# EAGLE design SlaveInput (EAGLE 9.3.2)
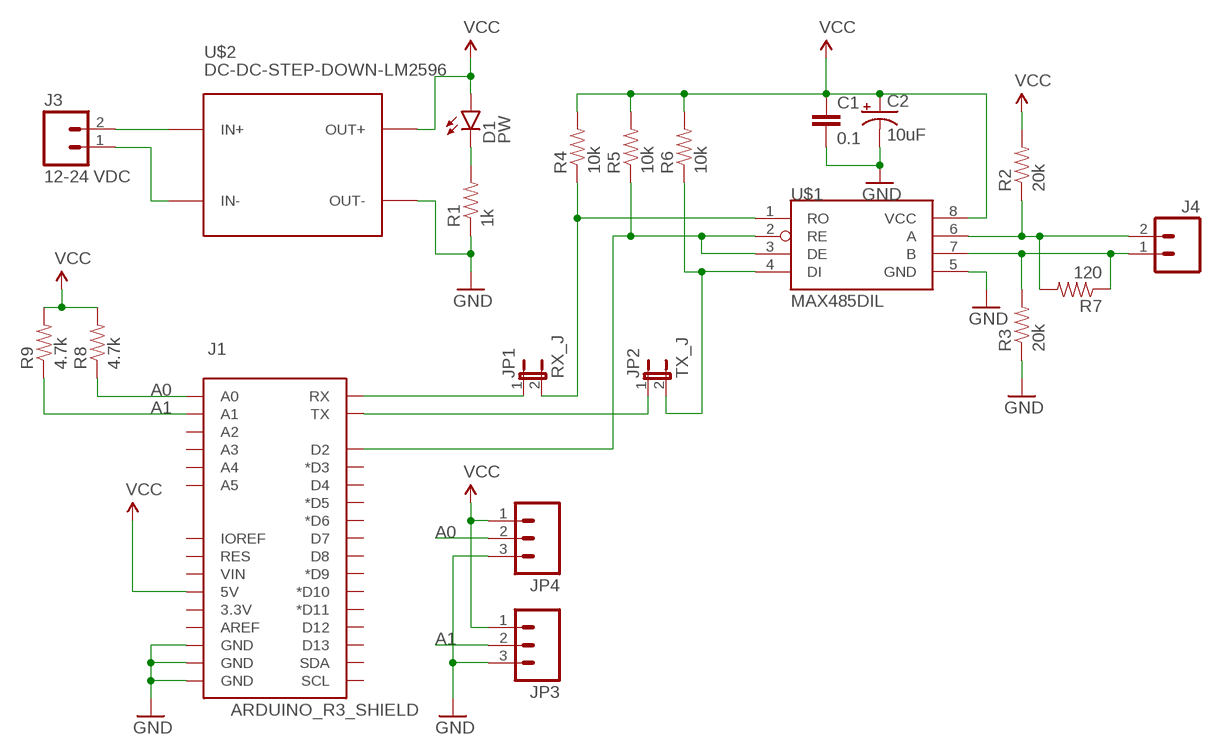
[diagram p0: schematic, sheet 1]

## Parts
C1  0.1  CAPPTH1  [CAP-PTH-5MM]
C2  10uF  CAP_POLPTH2  [CPOL-RADIAL-10UF-25V]
D1  PW  LED3MM  [LED3MM]
J1  ARDUINO_R3_SHIELD  [UNO_R3_SHIELD]
J3  12-24 VDC  M025MM  [SCREWTERMINAL-5MM-2]
J4  M025MM  [SCREWTERMINAL-5MM-2]
JP1  RX_J  JUMPER-2PTH  [1X02]
JP2  TX_J  JUMPER-2PTH  [1X02]
JP3  M03-SCREW-5MM  [SCREWTERMINAL-5MM-3]
JP4  M03-SCREW-5MM  [SCREWTERMINAL-5MM-3]
R1  1k  RESISTORAXIAL-0.3  [AXIAL-0.3]
R2  20k  RESISTORAXIAL-0.3  [AXIAL-0.3]
R3  20k  RESISTORAXIAL-0.3  [AXIAL-0.3]
R4  10k  RESISTORAXIAL-0.3  [AXIAL-0.3]
R5  10k  RESISTORAXIAL-0.3  [AXIAL-0.3]
R6  10k  RESISTORAXIAL-0.3  [AXIAL-0.3]
R7  120  RESISTORAXIAL-0.3  [AXIAL-0.3]
R8  4.7k  RESISTORAXIAL-0.3  [AXIAL-0.3]
R9  4.7k  RESISTORAXIAL-0.3  [AXIAL-0.3]
U$1  MAX485DIL  [DIL08]
U$2  DC-DC-STEP-DOWN-LM2596  [DC-DC-STEP-DOWN-LM2596]

## Nets
A0: J1.A0 JP4.2 R8.P$1
A1: J1.A1 JP3.2 R9.P$1
GND: C1.2 C2.2(-) J1.GND@0(GND) J1.GND@1(GND) J1.GND@2(GND) JP3.3 JP4.3 R1.P$1 R3.P$1 U$1.5(GND) U$2.OUT-
N$1: J3.2 U$2.IN+
N$2: J3.1 U$2.IN-
N$3: J4.2 R2.P$1 R7.P$2 U$1.6(A)
N$4: J4.1 R3.P$2 R7.P$1 U$1.7(B)
N$5: D1.K(C) R1.P$2
N$6: J1.RX JP1.1
N$7: J1.TX JP2.1
N$8: JP1.2 R4.P$1 U$1.1(RO)
N$9: JP2.2 R6.P$1 U$1.4(DI)
N$14: J1.D2 R5.P$1 U$1.2(RE) U$1.3(DE)
VCC: C1.1 C2.1(+) D1.A J1.5V JP3.1 JP4.1 R2.P$2 R4.P$2 R5.P$2 R6.P$2 R8.P$2 R9.P$2 U$1.8(VCC) U$2.OUT+
Unconnected: J1.3.3V J1.A2 J1.A3 J1.A4 J1.A5 J1.AREF J1.D3(*D3) J1.D4 J1.D5(*D5) J1.D6(*D6) J1.D7 J1.D8 J1.D9(*D9) J1.D10(*D10) J1.D11(*D11) J1.D12 J1.D13 J1.IOREF J1.RES J1.SCL J1.SDA J1.VIN

## Library data of the parts
C1 = SparkFun-Capacitors:CAP: Capacitor Standard 0603 ceramic capacitor, and 0.1" leaded capacitor.
C2 = SparkFun-Capacitors:CAP_POL: Capacitor Polarized These are standard SMD and PTH capacitors. Normally 10uF, 47uF, and 100uF in electrolytic and tantalum varieties. Always verify the external diameter of the through hole cap, it varies with capacity, voltage, and manufacturer. The EIA devices should be standard.
D1 = SparkFun-LED:LED: LEDs Standard schematic elements and footprints for 5mm, 3mm, 1206, and 0603 sized LEDs. 5mm - Spark Fun Electronics SKU : COM-00529 (and others); PROD_ID: DIO-08794
J1 = SparkFun-Boards:ARDUINO_R3_SHIELD: Shield form compatible with the Arduino Uno R3.
J3 J4 = SparkFun-Connectors:M02: Standard 2-pin 0.1" header. Use with - straight break away headers ( PRT-00116) - right angle break away headers (PRT-00553) - swiss pins (PRT-00743) - machine pins (PRT-00117) - female headers (PRT-00115) Molex polarized connector foot print use with: PRT-08233 with associated crimp pins and housings. 2.54_SCREWTERM for use with PRT-10571. 3.5mm Screw Terminal footprints for PRT-08084 5mm Screw Terminal footprints for use with PRT-08432; STOREFRONT_ID: PRT-08432
JP1 JP2 = SparkFun:JUMPER-2: Jumper Basic 0.1" spaced jumper. Use with breakaway headers.
JP3 JP4 = SparkFun:M03: Header 3 Standard 3-pin 0.1" header. Use with straight break away headers (SKU : PRT-00116), right angle break away headers (PRT-00553), swiss pins (PRT-00743), machine pins (PRT-00117), and female headers (PRT-00115). Molex polarized connector foot print use with SKU : PRT-08232 with associated crimp pins and housings.
R1-R9 = SparkFun:RESISTOR: Resistor Basic schematic elements and footprints for 0603, 1206, and PTH resistors.
U$1 = SparkFun:MAX485
U$2 = diy-modules:DC-DC-STEP-DOWN-LM2596: DC/DC Step-Down Regulator based on LM2596-ADJ chip LM2596 datasheet available here: http://www.ti.com/lit/ds/symlink/lm2596.pdf Click here to find device on ebay.com <http://www.ebay.com/sch/lm2596+power+regulator>

## Board
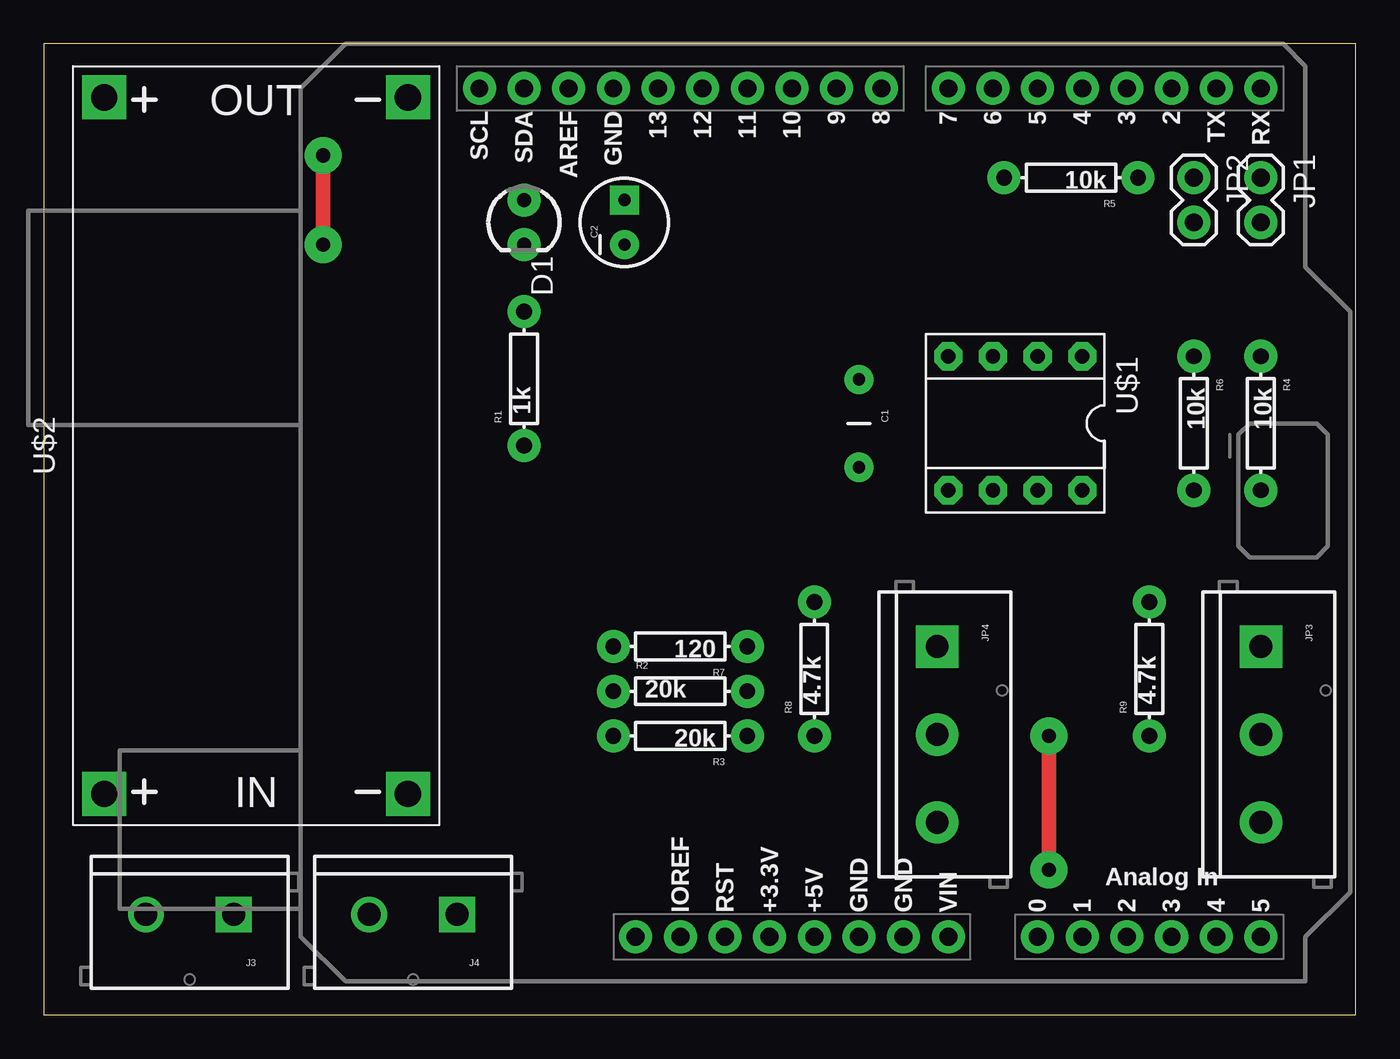
[diagram p1: board, top side]
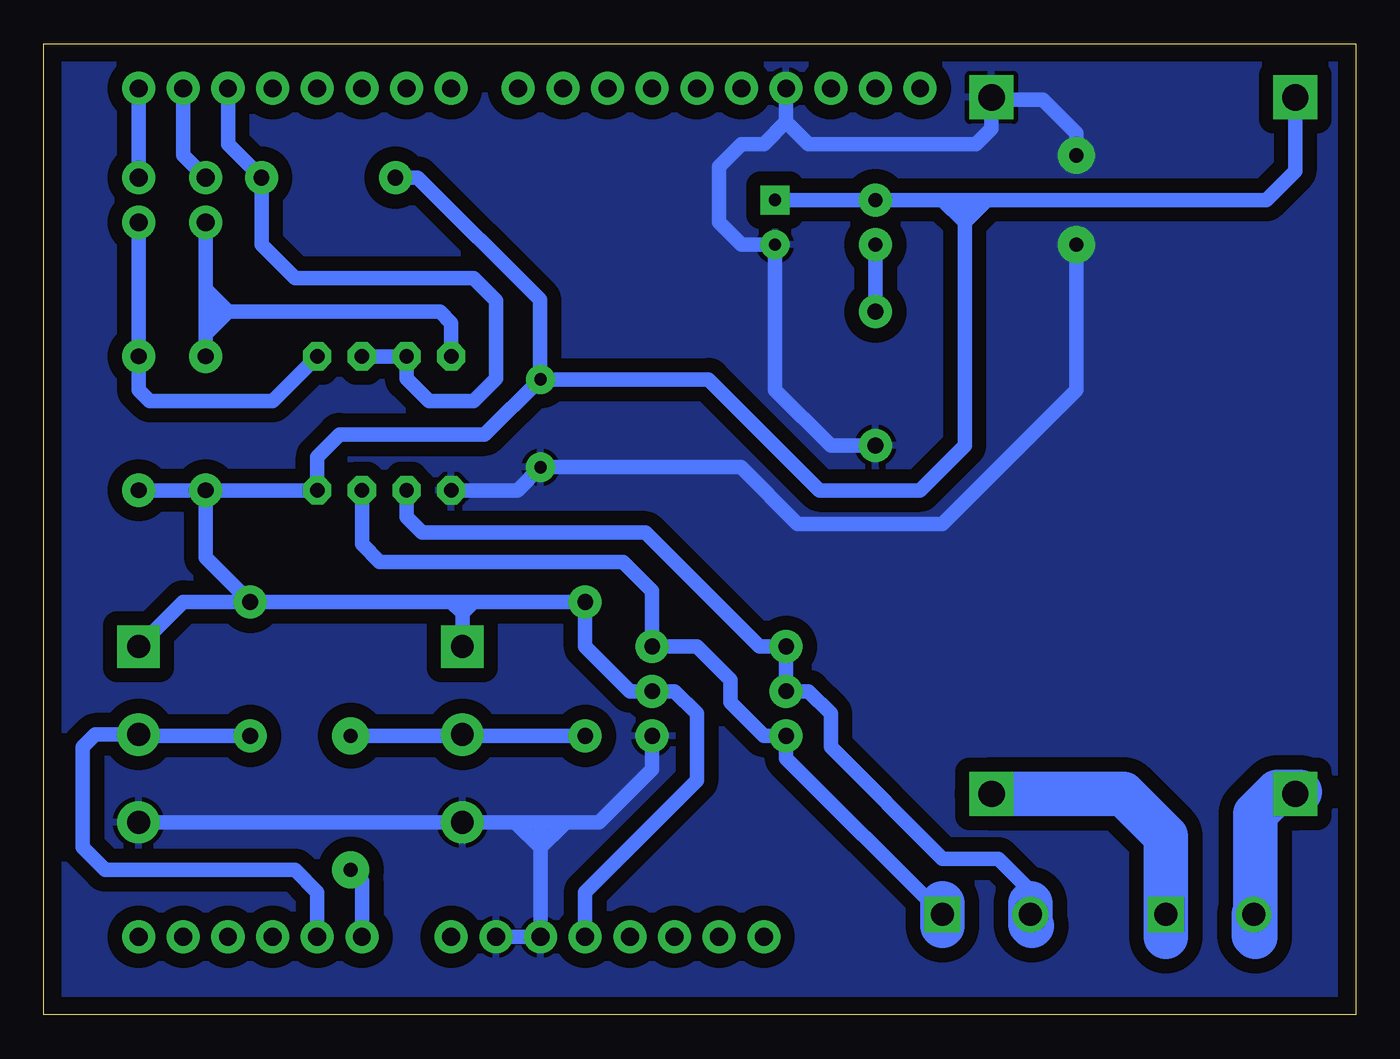
[diagram p2: board, bottom side, seen from below]

Size 74.6 x 55.23 mm. Coordinates in mm from the lower left corner, seen from the top.
Outline: 0,0 74.6,0 74.6,55.23 0,55.23 0,0
Copper layers (1*16): Top 0.035mm / dielectric 1.5mm / Bottom 0.035mm
Design rules "default": minimum track width 6mil, minimum drill 0.35mm, track to track 6mil, track to pad 6mil, pad to pad 6mil, via to via 6mil, smd to smd 6mil, copper to edge 40mil, drill to drill 6mil, minimum pad ring 10mil, minimum via ring 8mil, stop-mask expansion 4mil, vias tented up to drill 0mil, thermal gap 10mil

### Footprints (pad centres in the part's own frame; a part is rotated, then mirrored left to right if it is on the bottom)
CAP-PTH-5MM = drill 0.7 pad 1.651: 1 -2.5,0; 2 2.5,0
CPOL-RADIAL-10UF-25V = drill 0.7 pad 1.651 square: 1 1.27,0 | drill 0.7 pad 1.651: 2 -1.27,0
LED3MM = drill 0.813 pad 1.88: A -1.27,0; K 1.27,0
UNO_R3_SHIELD = drill 1.016 pad 1.88: 3.3V 50.8,26.67; 5V 50.8,29.21; A0 50.8,41.91; A1 50.8,44.45; A2 50.8,46.99; A3 50.8,49.53; A4 50.8,52.07; A5 50.8,54.61; AREF 2.54,15.24; D2 2.54,49.53; D3 2.54,46.99; D4 2.54,44.45; D5 2.54,41.91; D6 2.54,39.37; D7 2.54,36.83; D8 2.54,33.02; D9 2.54,30.48; D10 2.54,27.94; D11 2.54,25.4; D12 2.54,22.86; D13 2.54,20.32; GND@0 50.8,31.75; GND@1 50.8,34.29; GND@2 2.54,17.78; IOREF 50.8,21.59; NC 50.8,19.05; RES 50.8,24.13; RX 2.54,54.61; SCL 2.54,10.16; SDA 2.54,12.7; TX 2.54,52.07; VIN 50.8,36.83
SCREWTERMINAL-5MM-2 = drill 1.3 pad 2.032 square: 1 0,0 | drill 1.3 pad 2.032: 2 5,0
1X02 = drill 1.016 pad 1.88: 1 0,0; 2 2.54,0
SCREWTERMINAL-5MM-3 = drill 1.3 pad 2.413 square: 1 0,0 | drill 1.3 pad 2.413: 2 5,0; 3 10,0
AXIAL-0.3 = drill 0.9 pad 1.88: P$1 -3.81,0; P$2 3.81,0
DIL08 = drill 0.813 pad 1.6 octagon: 1 -3.81,-3.81; 2 -1.27,-3.81; 3 1.27,-3.81; 4 3.81,-3.81; 5 3.81,3.81; 6 1.27,3.81; 7 -1.27,3.81; 8 -3.81,3.81
DC-DC-STEP-DOWN-LM2596 = drill 1.5 pad 2.5 square: IN+ -19.812,8.636; IN- -19.812,-8.636; OUT+ 19.812,8.636; OUT- 19.812,-8.636

### Placement (x,y rotation side)
C1  46.36,33.66 270 top
C2  33.02,45.09 90 top
D1  27.3,45.09 270 top
J1  14.61,55.25 270 top
J3  10.8,5.72 180 top
J4  23.5,5.72 180 top
JP1  69.22,47.62 270 top
JP2  65.41,47.62 270 top
JP3  69.22,20.95 270 top
JP4  50.8,20.95 270 top
R1  27.3,36.2 90 top
R2  36.2,18.41 0 top
R3  36.2,15.88 180 top
R4  69.22,33.66 270 top
R5  58.42,47.62 180 top
R6  65.41,33.66 270 top
R7  36.2,20.95 180 top
R8  43.81,19.68 90 top
R9  62.86,19.68 90 top
U$1  55.24,33.66 180 top
U$2  12.07,32.39 90 top

### Tracks (layer width: path | path; a pad name or v marks a point on that pad's centre or on a via)
A0  (via drill 0.8 pad 2.1)
  Top 0.813: v57.15,15.88 v57.15,8.25
  Bottom 0.813: R8.P$1 50.72,15.88 | 50.72,15.88 JP4.2 | 50.72,15.88 v57.15,15.88 | v57.15,8.25 56.52,7.62 J1.A0
A1
  Bottom 0.813: R9.P$1 69.14,15.88 JP3.2 71.67,15.95 72.39,15.24 72.39,9.52 71.12,8.25 60.33,8.25 59.06,6.99 J1.A1
GND  (via drill 0.8 pad 2.1)
  Top 0.813: v15.88,43.82 v15.88,48.9
  Bottom 0.813: U$1.5 47.66,29.85 C1.2 34.97,31.15 31.75,27.94 23.5,27.94 15.88,35.56 v15.88,43.82 | J1.GND@1 J1.GND@0 46.36,9.52 | U$2.OUT- 20.7,52.07 | 20.7,52.07 20.7,50.42 21.59,49.53 31.12,49.53 32.38,50.8 | 32.38,50.8 J1.GND@2 | R1.P$1 29.84,32.39 33.02,35.56 C2.2 34.92,43.82 36.2,45.09 36.2,48.26 34.92,49.53 33.66,49.53 32.38,50.8 | v15.88,48.9 15.88,50.17 17.78,52.07 20.7,52.07 | JP3.3 JP4.3 47.62,10.96 | R3.P$1 40.01,13.97 43.02,10.96 45.09,10.96 | 45.09,10.96 46.36,10.96 | 46.36,10.96 47.62,10.96 | 46.36,9.52 46.36,10.96 | 46.36,9.52 45.09,10.8 45.09,10.96 | 46.36,9.52 47.62,10.8 47.62,10.96
  pour Bottom (isolate 0.813): 0,55.25 74.3,55.25 74.3,0 0,0
N$1
  Bottom 2.54: J3.2 5.79,4.53 5.71,4.45 5.71,11.43 4.44,12.7 3.3,12.7 | 3.17,12.7 3.3,12.7 | 3.3,12.7 U$2.IN+
N$2
  Bottom 2.54: 10.8,4.45 J3.1 10.8,10.16 13.21,12.57 U$2.IN-
N$3
  Bottom 0.813: 18.5,6.35 18.5,7.07 20.32,8.89 23.5,8.89 29.84,15.24 29.84,17.14 31.12,18.41 R2.P$1 | R2.P$1 R7.P$2 33.91,20.95 40.39,27.43 53.09,27.43 53.98,28.32 U$1.6 | 32.38,19.05 R2.P$1
  Bottom 2.54: 18.5,6.35 J4.2 18.5,5.16 18.41,5.08
N$4
  Bottom 0.813: J4.1 32.38,14.61 R3.P$2 33.66,15.88 35.56,17.78 35.56,19.05 37.47,20.95 R7.P$1 40.01,24.13 41.66,25.78 55.5,25.78 56.52,26.8 U$1.7
  Bottom 2.54: 23.5,6.35 J4.1 23.5,5.08
N$5
  Bottom 0.813: D1.K R1.P$2
N$6
  Bottom 0.813: JP1.1 J1.RX
N$7
  Bottom 0.813: JP2.1 66.67,48.9 J1.TX
N$8
  Bottom 0.813: U$1.1 61.59,34.93 68.58,34.93 69.22,35.56 R4.P$1 JP1.2
N$9
  Bottom 0.813: JP2.2 65.41,41.28 | 65.41,41.28 65.41,40.01 | 65.41,40.01 65.41,38.73 | 65.41,38.73 R6.P$1 | U$1.4 51.44,39.37 52.07,40.01 64.14,40.01 | 64.14,40.01 65.41,40.01 | 64.14,40.01 65.41,41.28 | 64.14,40.01 65.41,38.73
N$14
  Bottom 0.813: U$1.2 U$1.3 53.98,36.2 52.7,34.93 50.16,34.93 48.9,36.2 48.9,40.64 50.16,41.91 60.33,41.91 62.23,43.82 R5.P$1 64.14,49.53 J1.D2
VCC
  Bottom 0.813: R6.P$2 U$1.8 59.06,31.75 57.78,33.02 49.53,33.02 46.4,36.16 | R6.P$2 R4.P$2 | 46.4,36.16 C1.1 36.79,36.16 30.48,29.85 24.77,29.85 22.23,32.39 22.23,45.09 | U$2.OUT+ 3.43,48.01 5.08,46.36 20.96,46.36 | 20.96,46.36 22.23,46.36 | 22.23,46.36 23.5,46.36 | 23.5,46.36 D1.A C2.1 | 46.4,36.16 46.4,40.68 53.34,47.62 R5.P$2 | 22.23,45.09 22.23,46.36 | 22.23,45.09 20.96,46.36 | 22.23,45.09 23.5,46.36 | R9.P$2 51.44,23.5 | 51.44,23.5 50.8,23.5 | 50.8,23.5 50.16,23.5 | 50.16,23.5 R8.P$2 43.81,20.95 41.27,18.41 R2.P$2 38.73,18.41 37.47,17.14 37.47,13.34 43.81,6.99 J1.5V | JP3.1 66.67,23.5 R9.P$2 | JP4.1 50.8,22.86 | 50.8,22.86 50.8,23.5 | 50.8,22.86 50.16,23.5 | 50.8,22.86 51.44,23.5 | R9.P$2 65.41,26.04 R6.P$2